# Altium project Light1002 V1.0.PrjPcb
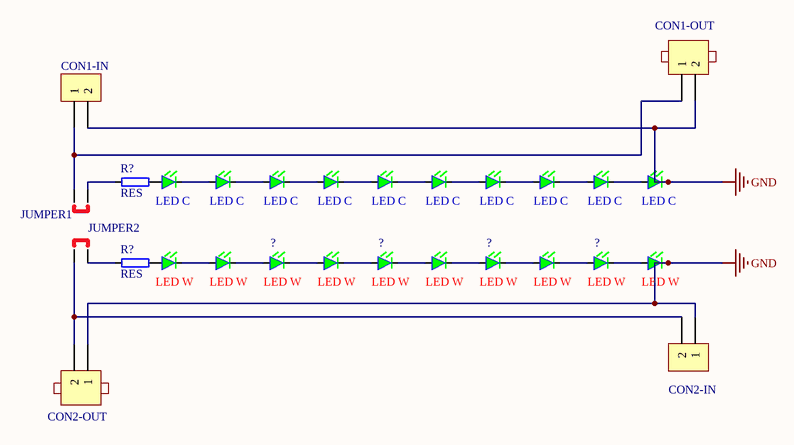
[diagram p0: Sheet1.SchDoc]
2 sheets, 28 parts. Net scope: global (net labels, ports and power ports of the same name join across sheets).
Board file: PCB1.PcbDoc
Sheets:
  Sheet1.SchDoc
  Sheet2.SchDoc

## Sheet Sheet1.SchDoc
size A4

### Parts
(Parts that share a designator on the sheet are numbered #1, #2 ... from top to bottom, then left to right.)
?#1  CON1-OUT  [AXIAL-0.6]
?#2  CON1-IN
?#3  LED C  [LED3]
?#4  LED C  [LED3]
?#5  LED C  [LED3]
?#6  LED C  [LED3]
?#7  LED C  [LED3]
?#8  LED C  [LED3]
?#9  LED C  [LED3]
?#10  LED C  [LED3]
?#11  LED C  [LED3]
?#12  LED C  [LED3]
?#13  JUMPER2  [RAD0.2]
?#14  JUMPER1  [RAD0.2]
?#15  LED W  [LED3]
?#16  LED W  [LED3]
?#17  LED W  [LED3]
?#18  LED W  [LED3]
?#19  LED W  [LED3]
?#20  LED W  [LED3]
?#21  LED W  [LED3]
?#22  LED W  [LED3]
?#23  LED W  [LED3]
?#24  LED W  [LED3]
?#25  CON2-IN
?#26  CON2-OUT  [AXIAL-0.6]
R?#1  RES  [AXIAL0.3]
R?#2  RES  [AXIAL0.3]

### Nets
GND: ?#1.2 ?#2.2 ?#12.K(k) ?#24.K(k) ?#25.1 ?#26.1
Net?#1_1: ?#1.1 ?#2.1 ?#13.2
Net?#3_A: ?#3.A(a) R?#1.2
Net?#3_K: ?#3.K(k) ?#4.A(a)
Net?#4_K: ?#4.K(k) ?#5.A(a)
Net?#5_K: ?#5.K(k) ?#6.A(a)
Net?#6_K: ?#6.K(k) ?#7.A(a)
Net?#7_K: ?#7.K(k) ?#8.A(a)
Net?#8_K: ?#8.K(k) ?#9.A(a)
Net?#9_K: ?#9.K(k) ?#10.A(a)
Net?#10_K: ?#10.K(k) ?#11.A(a)
Net?#11_K: ?#11.K(k) ?#12.A(a)
Net?#13_1: ?#13.1 R?#1.1
Net?#14_1: ?#14.1 ?#25.2 ?#26.2
Net?#14_2: ?#14.2 R?#2.1
Net?#15_A: ?#15.A(a) R?#2.2
Net?#15_K: ?#15.K(k) ?#16.A(a)
Net?#16_K: ?#16.K(k) ?#17.A(a)
Net?#17_K: ?#17.K(k) ?#18.A(a)
Net?#18_K: ?#18.K(k) ?#19.A(a)
Net?#19_K: ?#19.K(k) ?#20.A(a)
Net?#20_K: ?#20.K(k) ?#21.A(a)
Net?#21_K: ?#21.K(k) ?#22.A(a)
Net?#22_K: ?#22.K(k) ?#23.A(a)
Net?#23_K: ?#23.K(k) ?#24.A(a)

### Library data of the parts
?#1 ?#26 = TJC3-2Y: Set Position: 0.5; Published: 8-Jun-2000; LatestRevisionDate: 17-Jul-2002; LatestRevisionNote: Re-released for DXP Platform.; PackageReference: AXIAL-0.6; Publisher: Altium Limited
?#2 ?#25 = CON2: Connector
?#3-?#12 ?#15-?#24 = LED
?#13 ?#14 = JUMPER2: Jumper

## Sheet Sheet2.SchDoc
size A4